# Altium schematic sheet ai.SchDoc
size A0; SheetNumber: 3; SheetTotal: 3
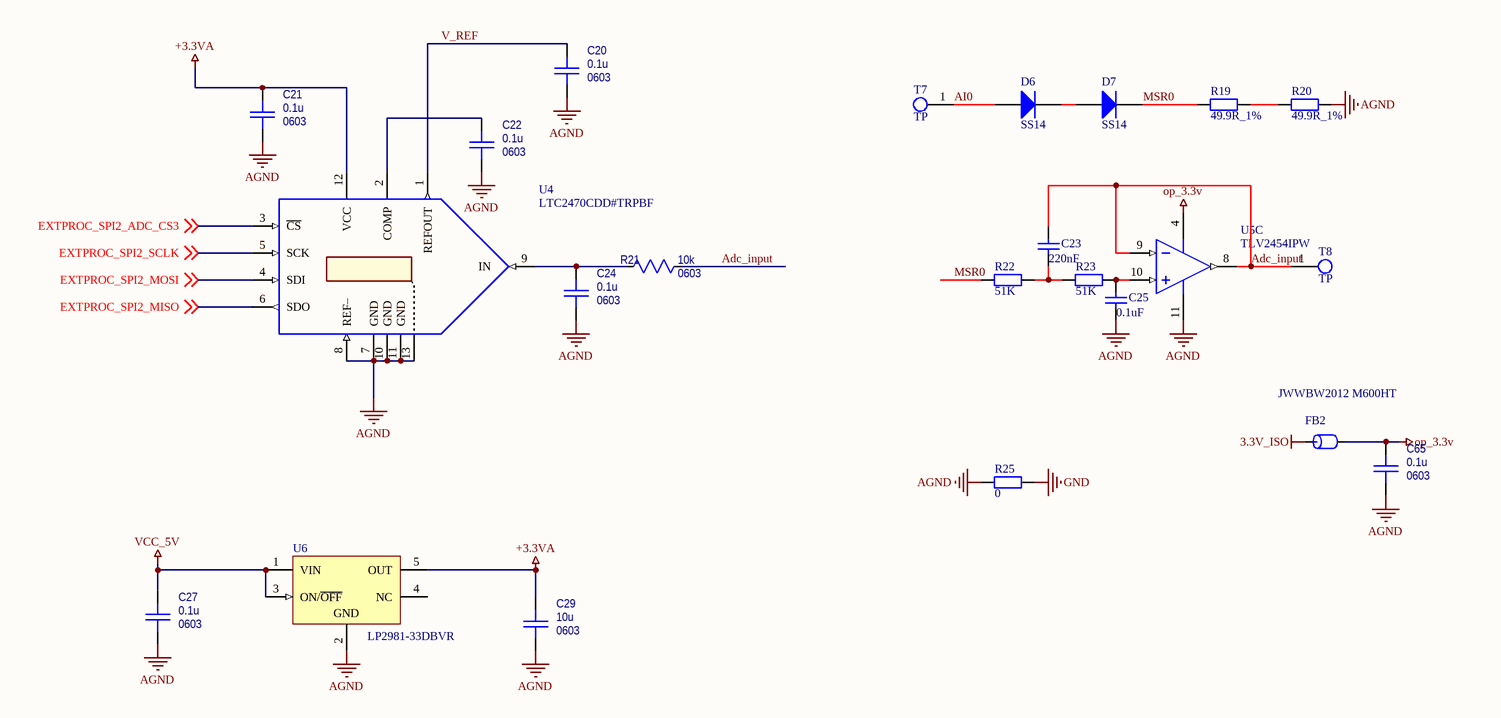
[diagram p0: ai.SchDoc]

## Parts
C20  value 0.1u  Package: 0603  [CAPC1608X092N_0603]  (hidden comment: Capacitor_0603)
C21  value 0.1u  Package: 0603  [CAPC1608X092N_0603]  (hidden comment: Capacitor_0603)
C22  value 0.1u  Package: 0603  [CAPC1608X092N_0603]  (hidden comment: Capacitor_0603)
C23  220nF  [0805C]
C24  value 0.1u  Package: 0603  [CAPC1608X092N_0603]  (hidden comment: Capacitor_0603)
C25  0.1uF  [0603C]
C27  value 0.1u  Package: 0603  [CAPC1608X092N_0603]  (hidden comment: Capacitor_0603)
C29  value 10u  Package: 0603  [CAPC1608X092N_0603]  (hidden comment: Capacitor_0603)
C65  value 0.1u  Package: 0603  [CAPC1608X092N_0603]  (hidden comment: Capacitor_0603)
D6  SS14  [DO-214AC]
D7  SS14  [DO-214AC]
FB2  JWWBW2012 M600HT  [0805R]
R19  49.9R_1%  [0805R]
R20  49.9R_1%  [0805R]
R21  value 10k  Package: 0603  [RESC1608X055N_0603]  (hidden comment: Resistor_0603)
R22  51K  [0603R]
R23  51K  [0603R]
R25  0  [1206R]
T7  TP  [TPD]
T8  TP  [TPD]
U4  LTC2470CDD#TRPBF  [LT-DD-12_V]
U5  TLV2454IPW  [TSSOP14]  (part C of 4)
U6  LP2981-33DBVR  [DBV0005A_M]

## Nets
3.3V_ISO: FB2.1
+3.3VA: C21.1 C29.1 U4.12(VCC) U6.5(OUT)
AGND: C20.2 C21.2 C22.2 C24.2 C25.1 C27.2 C29.2 C65.2 R20.1 R25.2 U4.7(GND) U4.8(REF–) U4.10(GND) U4.11(GND) U4.13(EP) U5.11(GND) U6.2(GND)
GND: R25.1
op_3.3v: C65.1 FB2.2 U5.4(V+)
VCC_5V: C27.1 U6.1(VIN) U6.3(ON/~{OFF})
Adc_input: C23.2 R21.1 T8.1 U5.8(OUT) U5.9(IN-)
AI0: D6.1(A) T7.1
EXTPROC_SPI2_ADC_CS3: U4.3(~{CS}) ; off-sheet EXTPROC_SPI2_ADC_CS3
EXTPROC_SPI2_MISO: U4.6(SDO) ; off-sheet EXTPROC_SPI2_MISO
EXTPROC_SPI2_MOSI: U4.4(SDI) ; off-sheet EXTPROC_SPI2_MOSI
EXTPROC_SPI2_SCLK: U4.5(SCK) ; off-sheet EXTPROC_SPI2_SCLK
MSR0: D7.2(K) R19.2 R22.2
V_REF: C20.1 U4.1(REFOUT)
NetC22_1: C22.1 U4.2(COMP)
NetC23_1: C23.1 R22.1 R23.2
NetC24_1: C24.1 R21.2 U4.9(IN)
NetC25_2: C25.2 R23.1 U5.10(IN+)
NetD6_2: D6.2(K) D7.1(A)
NetR19_1: R19.1 R20.2

Not connected (* = marked no-connect by the designer): U6 4(NC)

## Library data of the parts
C20-C22 C24 C27 C65 = Capacitor_0603: Capacitor, MLCC; PartNumber: C0603C104M5RACTU; Tolerance: [tol]; TempCo: [tempco]; Voltage Rating: [voltage]; ComponentLink1URL: *; ComponentLink1Description: Datasheet; SupplierDescription: CAP CER 0.1UF 50V X7R 0603
C23 C25 = Cap: Capacitor; Published: 8-Jun-2000; LatestRevisionDate: 17-Jul-2002; LatestRevisionNote: Re-released for DXP Platform.; PackageReference: RAD-0.3; Publisher: Altium Limited; PackageDescription: Radial Cap, Thru-Hole; 2 Leads; 0.3 in Pin Spacing
C29 = Capacitor_0603: Capacitor, MLCC; PartNumber: GRM188R61A106KE69D; Tolerance: [tol]; TempCo: [tempco]; Voltage Rating: [voltage]; ComponentLink1URL: *; ComponentLink1Description: Datasheet; SupplierDescription: CAP CER 10UF 10V X5R 0603
D6 D7 = Diode: Default Diode; Published: 8-Jun-2000; LatestRevisionDate: 17-Jul-2002; LatestRevisionNote: Re-released for DXP Platform.; PackageVersion: Sep-1996; PackageReference: SMC; Publisher: Altium Limited; Code_JEDEC: DO-214-AB
FB2 = FB: Part Field 1: 磁珠/0603/1K ohm/100MHz; FB: BLM18BD102SN1(muRata); Text Field1: FB
R19 R20 R22 R23 R25 = Res0805M
R21 = Resistor_0603: Resistor, Standard; PartNumber: RR0816P-103-D; TempCo: [tempco]; Tolerance: tol; ComponentLink1URL: *; ComponentLink1Description: Datasheet; SupplierDescription: RES SMD 10K OHM 0.5% 1/16W 0603
U4 = LTC2470CDD#TRPBF: 16-bit Analog-to-digital Converters, 12-pin SON (DD-12), 0 to 70 degC, Pb-Free, Tape and Reel; PartNumber: LTC2470CDD#TRPBF; ComponentLink2URL: https://www.analog.com/media/en/technical-documentation/data-sheets/24702fb.pdf; ComponentLink1URL: http://www.linear.com/; ComponentLink2Description: Datasheet; ComponentLink1Description: Manufacturer URL; Value: LTC2470CDD#TRPBF
U5 = MAX908EPD: Quad High-speed, Ultra Low-power, Single-Supply TTL comparator; Published: 16-Jan-2001; LatestRevisionDate: 29-May-2009; LatestRevisionNote: Component Body Added.; DatasheetVersion: Jul-1994; PackageVersion: RevB, 21-0043; PackageReference: PD14; Publisher: Altium Limited; PackageDescription: DIP, 14-Pin, Row Spacing 7.62 mm, Pitch 2.54 mm; Code_JEDEC: MS-001-AC; ComponentLink1Description: Manufacturer Link; ComponentLink1URL: http://www.maxim-ic.com/; ComponentLink2Description: Datasheet; ComponentLink2URL: http://pdfserv.maxim-ic.com/en/ds/MAX907-MAX909.pdf
U6 = LP2981-33DBVR: Micropower 100 mA Ultra Low-Dropout Regulator, 5-pin SOT-23, Pb-Free; ComponentLink1URL: http://www.ti.com/general/docs/lit/getliterature.tsp?genericPartNumber=LP2981-N&fileType=pdf; ComponentLink1Description: Datasheet URL; Value: LP2981-33DBVR